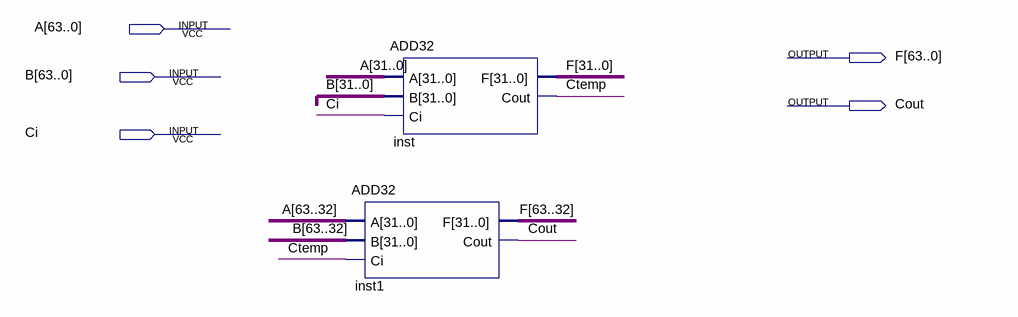
[diagram p0: schematic sheet]
// Quartus schematic ADD64.bdf as structural Verilog: 2 symbols, 5 pins
module ADD64 (
  input  [63:0] A,
  input  [63:0] B,
  input  Ci,
  output [63:0] F,
  output Cout
);

  wire Ctemp;

  ADD32 inst1 (.A(A[63:32]), .B(B[63:32]), .Ci(Ctemp), .F(F[63:32]), .Cout(Cout));
  ADD32 inst (.A(A[31:0]), .B(B[31:0]), .Ci(Ci), .F(F[31:0]), .Cout(Ctemp));
endmodule
